# EAGLE board Arduino_kuukulgur-alternatiivne3 (EAGLE 6.3)
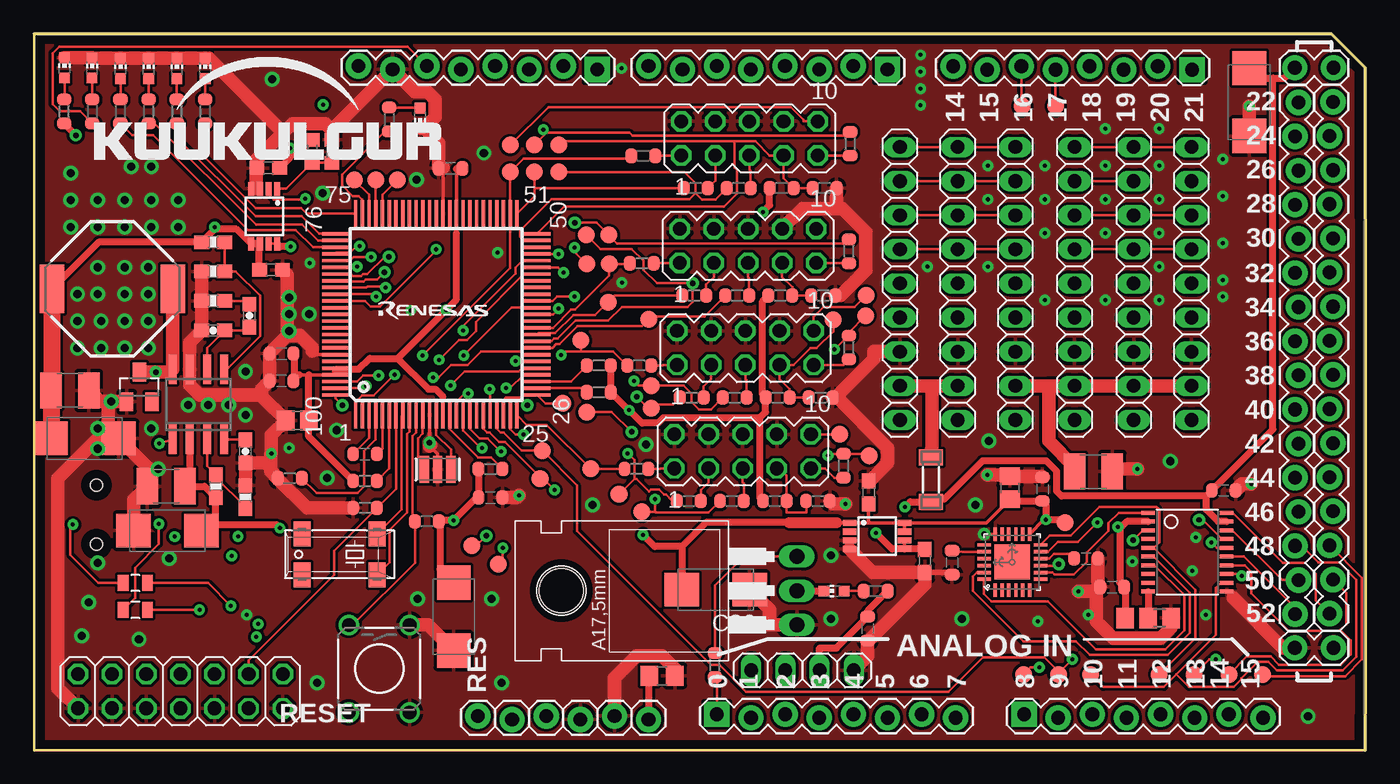
[diagram p8: board, top side]
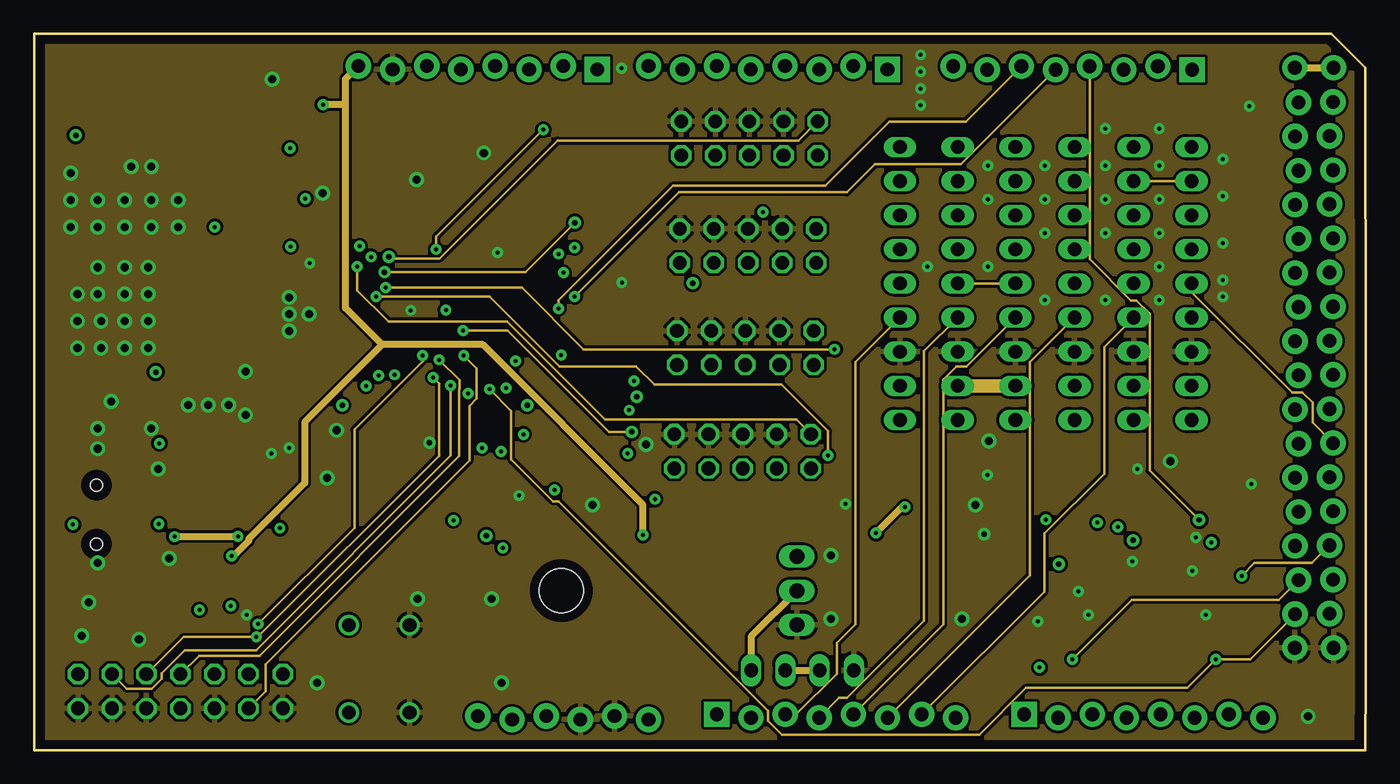
[diagram p9: board, inner layer Route2]
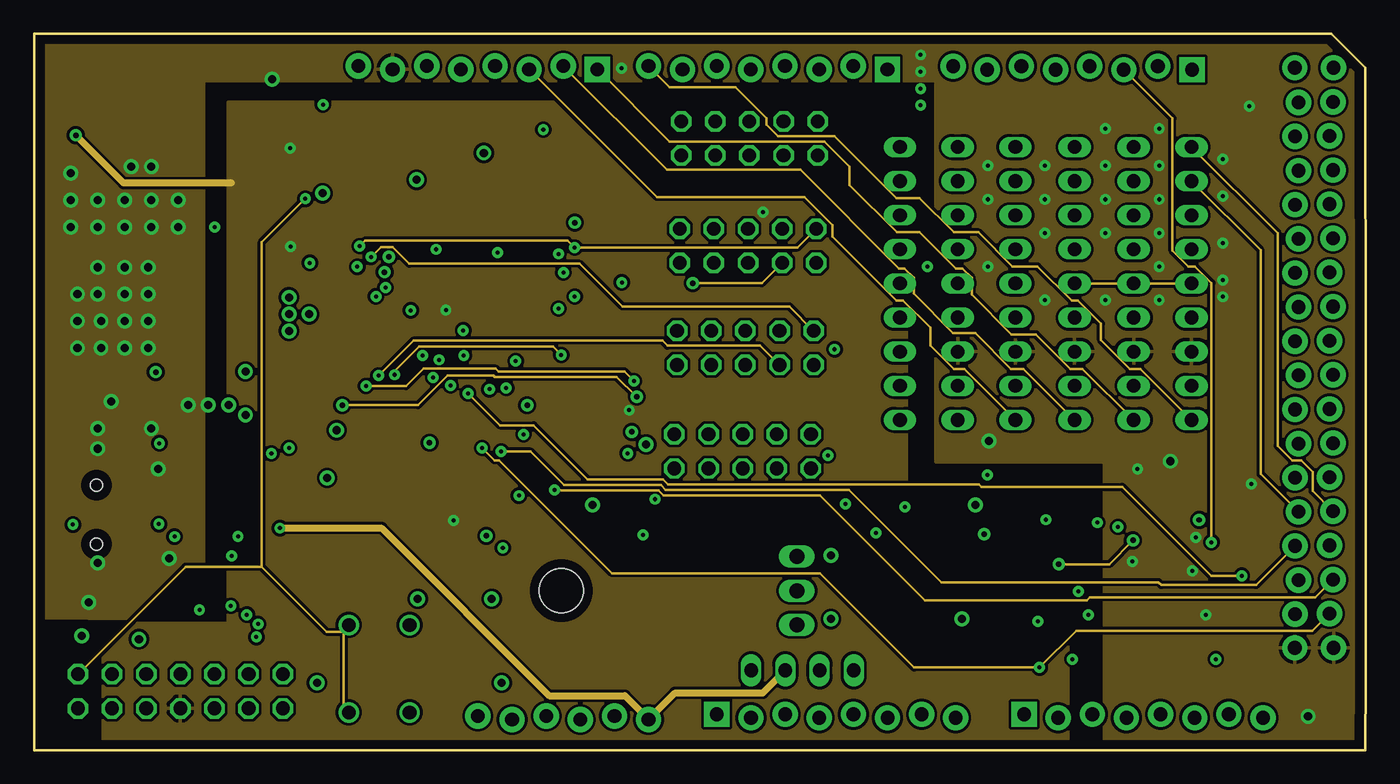
[diagram p10: board, inner layer Route15]
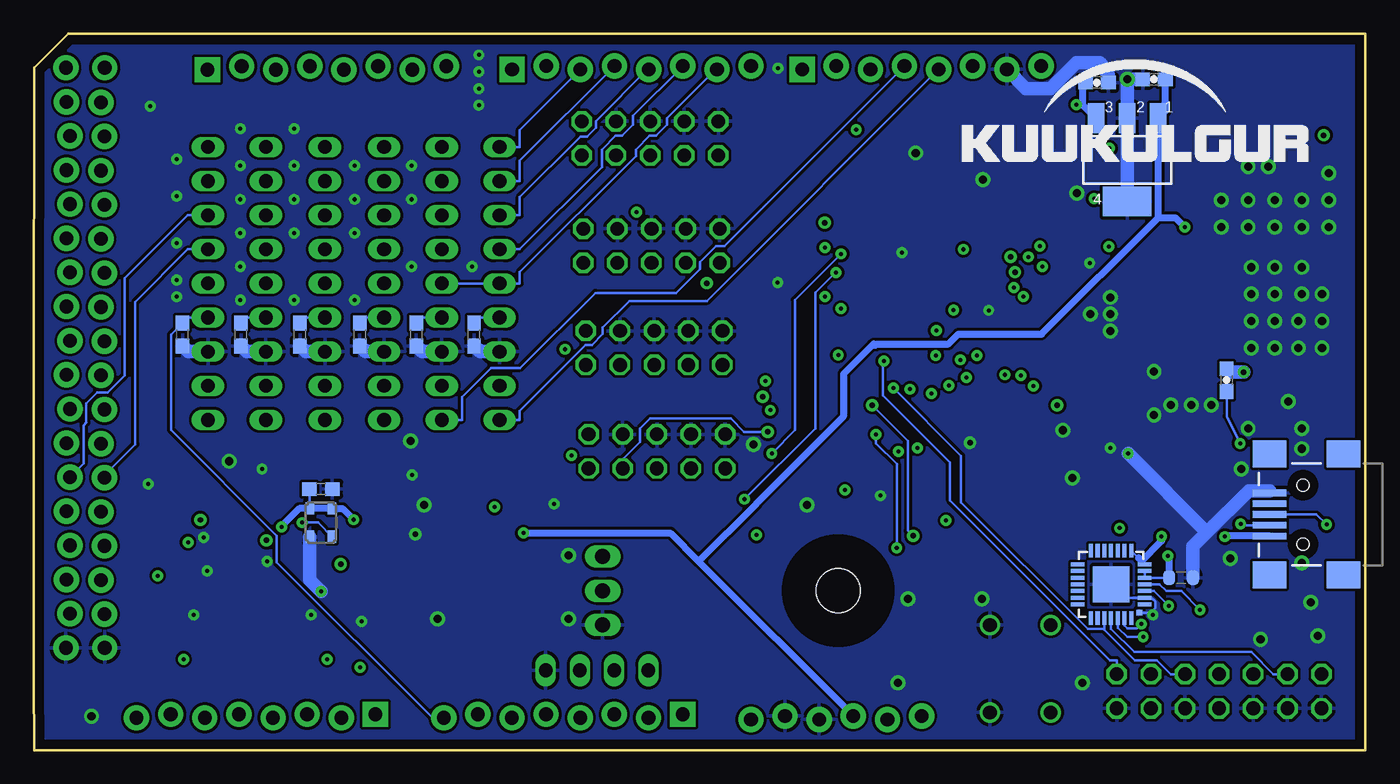
[diagram p11: board, bottom side, seen from below]

Size 99.1 x 53.34 mm. Coordinates in mm from the lower left corner, seen from the top.
Outline: 0,0 99.06,0 99.06,1.27 99.1,4.11 99.1,38.4 99.06,40.64 99.06,50.8 96.52,53.34 0,53.34 0,0
Copper layers (1*2+15*16): Top 0.035mm / dielectric 0.2mm / Route2 0.035mm / dielectric 0.15mm / Route15 0.035mm / dielectric 0.2mm / Bottom 0.035mm
Design rules "default *": minimum track width 8mil, minimum drill 16mil, track to track 6mil, track to pad 7mil, pad to pad 8mil, via to via 10mil, smd to smd 7mil, copper to edge 27mil, drill to drill 12mil, minimum pad ring 10mil, minimum via ring 10mil, stop-mask expansion 2mil, vias tented up to drill 24mil, thermal gap 10mil
Net classes: 0 default: width 0.203 mm, drill 0.203 mm, clearance 0.203 mm; 1 power: width 0.508 mm, drill 0.508 mm, clearance 0.203 mm; 2 morepower: width 1.016 mm, drill 0.508 mm, clearance 0.203 mm; 3 gnd: width 0.305 mm, drill 0.305 mm, clearance 0.203 mm

## Footprints (pad centres in the part's own frame; a part is rotated, then mirrored left to right if it is on the bottom)
C0603-ROUND = smd 0.898 x 1.1: 1 -0.889,0; 2 0.889,0
C0805 = smd 1.3 x 1.5: 1 -0.95,0; 2 0.95,0
0603-CAP = smd 1.1 x 1: 1 -0.85,0; 2 0.85,0
C0805' = smd 1.3 x 1.5: 1 -0.85,0; 2 0.85,0
C1210 = smd 1.6 x 2.7: 1 -1.4,0; 2 1.4,0
C0603 = smd 1.1 x 1: 1 -0.85,0; 2 0.85,0
C/6032-28R = smd 2.55 x 2.5: + 2.525,0; - -2.525,0
SOT23 = smd 1 x 1.4: 1 -0.95,-1.1; 2 0.95,-1.1; 3 0,1.1
MSOP8 = smd 0.45 x 1: 1 -0.975,-2.05; 2 -0.325,-2.05; 3 0.325,-2.05; 4 0.975,-2.05; 5 0.975,2.05; 6 0.325,2.05; 7 -0.325,2.05; 8 -0.975,2.05
MLP28 = smd 1 x 0.3: 1 -2.5,1.5; 2 -2.5,1; 3 -2.5,0.5; 4 -2.5,0; 5 -2.5,-0.5; 6 -2.5,-1; 7 -2.5,-1.5; 15 2.5,-1.5; 16 2.5,-1; 17 2.5,-0.5; 18 2.5,0; 19 2.5,0.5; 20 2.5,1; 21 2.5,1.5 | smd 0.3 x 1: 8 -1.5,-2.5; 9 -1,-2.5; 10 -0.5,-2.5; 11 0,-2.5; 12 0.5,-2.5; 13 1,-2.5; 14 1.5,-2.5; 22 1.5,2.5; 23 1,2.5; 24 0.5,2.5; 25 0,2.5; 26 -0.5,2.5; 27 -1,2.5; 28 -1.5,2.5 | smd 2.7 x 2.7: EXP 0,0 | smd 0.435 x 0.435: M -2.103,2.103
SOT223 = smd 1.219 x 2.235: 1 -2.311,-3.099; 2 0,-3.099; 3 2.311,-3.099 | smd 3.6 x 2.2: 4 0,3.099
B0R-JMP = smd 1.5 x 1.3: 1 0,1.7; 2 0,0; 3 0,-1.7
1X08_LOCK = drill 1.016 pad 1.88 square: 1 0,0.127 | drill 1.016 pad 1.88: 2 2.54,-0.127; 3 5.08,0.127; 4 7.62,-0.127; 5 10.16,0.127; 6 12.7,-0.127; 7 15.24,0.127; 8 17.78,-0.127
1X02 = drill 1.016 long: 1 -1.27,0; 2 1.27,0
1X16_LOCK = drill 1.016 pad 1.88: 1 0,0.127; 2 2.54,-0.127; 3 5.08,0.127; 4 7.62,-0.127; 5 10.16,0.127; 6 12.7,-0.127; 7 15.24,0.127; 8 17.78,-0.127; 9 20.32,0.127; 10 22.86,-0.127; 11 25.4,0.127; 12 27.94,-0.127; 13 30.48,0.127; 14 33.02,-0.127; 15 35.56,0.127; 16 38.1,-0.127
1X06_LOCK = drill 1.016 pad 1.88: 1 0,0; 2 2.54,-0.254; 3 5.08,0; 4 7.62,-0.254; 5 10.16,0; 6 12.7,-0.254
1X02_LOCK = drill 1.016 pad 1.88: 1 -0.178,0; 2 2.718,0
1X09 = drill 1.016 long: 1 -10.16,0; 2 -7.62,0; 3 -5.08,0; 4 -2.54,0; 5 0,0; 6 2.54,0; 7 5.08,0; 8 7.62,0; 9 10.16,0
2X07 = drill 1.016 octagon: 1 -7.62,-1.27; 2 -7.62,1.27; 3 -5.08,-1.27; 4 -5.08,1.27; 5 -2.54,-1.27; 6 -2.54,1.27; 7 0,-1.27; 8 0,1.27; 9 2.54,-1.27; 10 2.54,1.27; 11 5.08,-1.27; 12 5.08,1.27; 13 7.62,-1.27; 14 7.62,1.27
SRU1038 = smd 1.8 x 3.6: 1 -4.5,0; 2 4.5,0
SM-1206 = smd 1.2 x 1.8: 1 -1.65,0; 2 1.65,0
CHIP-LED0603 = smd 0.8 x 0.8: A 0,-0.75; C 0,0.75
100P6Q-A = smd 0.25 x 2: 1 -6,-7.5; 2 -5.5,-7.5; 3 -5,-7.5; 4 -4.5,-7.5; 5 -4,-7.5; 6 -3.5,-7.5; 7 -3,-7.5; 8 -2.5,-7.5; 9 -2,-7.5; 10 -1.5,-7.5; 11 -1,-7.5; 12 -0.5,-7.5; 13 0,-7.5; 14 0.5,-7.5; 15 1,-7.5; 16 1.5,-7.5; 17 2,-7.5; 18 2.5,-7.5; 19 3,-7.5; 20 3.5,-7.5; 21 4,-7.5; 22 4.5,-7.5; 23 5,-7.5; 24 5.5,-7.5; 25 6,-7.5; 51 6,7.5; 52 5.5,7.5; 53 5,7.5; 54 4.5,7.5; 55 4,7.5; 56 3.5,7.5; 57 3,7.5; 58 2.5,7.5; 59 2,7.5; 60 1.5,7.5; 61 1,7.5; 62 0.5,7.5; 63 0,7.5; 64 -0.5,7.5; 65 -1,7.5; 66 -1.5,7.5; 67 -2,7.5; 68 -2.5,7.5; 69 -3,7.5; 70 -3.5,7.5; 71 -4,7.5; 72 -4.5,7.5; 73 -5,7.5; 74 -5.5,7.5; 75 -6,7.5 | smd 2 x 0.25: 26 7.5,-6; 27 7.5,-5.5; 28 7.5,-5; 29 7.5,-4.5; 30 7.5,-4; 31 7.5,-3.5; 32 7.5,-3; 33 7.5,-2.5; 34 7.5,-2; 35 7.5,-1.5; 36 7.5,-1; 37 7.5,-0.5; 38 7.5,0; 39 7.5,0.5; 40 7.5,1; 41 7.5,1.5; 42 7.5,2; 43 7.5,2.5; 44 7.5,3; 45 7.5,3.5; 46 7.5,4; 47 7.5,4.5; 48 7.5,5; 49 7.5,5.5; 50 7.5,6; 76 -7.5,6; 77 -7.5,5.5; 78 -7.5,5; 79 -7.5,4.5; 80 -7.5,4; 81 -7.5,3.5; 82 -7.5,3; 83 -7.5,2.5; 84 -7.5,2; 85 -7.5,1.5; 86 -7.5,1; 87 -7.5,0.5; 88 -7.5,0; 89 -7.5,-0.5; 90 -7.5,-1; 91 -7.5,-1.5; 92 -7.5,-2; 93 -7.5,-2.5; 94 -7.5,-3; 95 -7.5,-3.5; 96 -7.5,-4; 97 -7.5,-4.5; 98 -7.5,-5; 99 -7.5,-5.5; 100 -7.5,-6
MA05-2 = drill 1.016 octagon: 1 -5.08,-1.27; 2 -5.08,1.27; 3 -2.54,-1.27; 4 -2.54,1.27; 5 0,-1.27; 6 0,1.27; 7 2.54,-1.27; 8 2.54,1.27; 9 5.08,-1.27; 10 5.08,1.27
MM20SS = smd 1.27 x 1.88: 1 -2.794,-1.524; 2 2.794,-1.524; 3 2.794,1.524; 4 -2.794,1.524
R0603-ROUND = smd 0.898 x 1.1: 1 -0.889,0; 2 0.889,0
0603-RES = smd 1.1 x 1: 1 -0.85,0; 2 0.85,0
0805 = smd 0.8 x 1.2: 1 -0.9,0; 2 0.9,0
R0603 = smd 1 x 1.1: 1 -0.85,0; 2 0.85,0
TACTILE-PTH = drill 1.016: 1 -3.251,2.261; 2 3.251,2.261; 3 -3.251,-2.261; 4 3.251,-2.261
TO220 = drill 1.118 long: 1 -2.54,-6.35; 2 0,-6.35; 3 2.54,-6.35 | hole 3.302: 0,11.176
B1,27 = smd 1.27 x 1.27: TP 0,0
QFN-24-TESTING = smd 1.016 x 0.254: 1 -2.066,1.257; 2 -2.066,0.75; 3 -2.066,0.247; 4 -2.066,-0.287; 5 -2.066,-0.792; 6 -2.066,-1.297; 13 2.086,-1.297; 14 2.086,-0.792; 15 2.086,-0.287; 16 2.086,0.247; 17 2.086,0.75; 18 2.086,1.257 | smd 0.254 x 1.016: 7 -1.267,-2.122; 8 -0.762,-2.122; 9 -0.258,-2.122; 10 0.278,-2.122; 11 0.78,-2.122; 12 1.287,-2.122; 19 1.287,2.082; 20 0.78,2.082; 21 0.278,2.082; 22 -0.258,2.082; 23 -0.762,2.082; 24 -1.267,2.082 | smd 2.616 x 2.616: P$1 0.02,-0.01
TSSOP20 = smd 0.305 x 0.991: 1 -2.925,-2.918; 2 -2.275,-2.918; 3 -1.625,-2.918; 4 -0.975,-2.918; 5 -0.325,-2.918; 6 0.325,-2.918; 7 0.975,-2.918; 8 1.625,-2.918; 9 2.275,-2.918; 10 2.925,-2.918; 11 2.925,2.918; 12 2.275,2.918; 13 1.625,2.918; 14 0.975,2.918; 15 0.325,2.918; 16 -0.325,2.918; 17 -0.975,2.918; 18 -1.625,2.918; 19 -2.275,2.918; 20 -2.925,2.918
ASE = smd 0.9 x 0.65: 1 -1.05,-0.825; 2 1.05,-0.825; 3 1.05,0.825; 4 -1.05,0.825
SO8 = smd 0.6 x 2.2: 1 -1.905,-2.6; 2 -0.635,-2.6; 3 0.635,-2.6; 4 1.905,-2.6; 5 1.905,2.6; 6 0.635,2.6; 7 -0.635,2.6; 8 -1.905,2.6
USB-MINIB = smd 2.5 x 0.5: D+ 2.5,0; D- 2.5,0.8; GND 2.5,-1.6; ID 2.5,-0.8; VBUS 2.5,1.6 | smd 2.5 x 2: GND@1 -3,-4.5; GND@2 -3,4.5; GND@3 2.5,4.5; GND@4 2.5,-4.5 | hole 0.9: 0,2.2; 0,-2.2
RESONATOR = smd 0.7 x 2: 1 -1,0; 2 0,0; 3 1,0

## Placement (x,y rotation side)
C1  100n  [C0603-ROUND]  18.41,29.52 180 top
C2  2.2nF, 50V  [C0603-ROUND]  68.31,13.95 90 top
C3  100n  [C0603-ROUND]  78.26,14.27 180 top
C4  100n  [C0603-ROUND]  30.98,43.31 180 top
C5  220n  [C0603-ROUND]  18.41,27.49 180 top
C6  100n  [C0603-ROUND]  33.96,18.8 0 top
C7  1uF/16V  [C0805]  46.72,5.54 0 top
C8  100n  [C0603-ROUND]  62.02,9.04 270 top
C9  180pF  [0603-CAP]  16.02,32.34 90 top
C10  4,7uF  [C0603-ROUND]  24.62,22.04 180 top
C11  12pF  [0603-CAP]  13.32,31.24 180 top
C12  47uF  [C0805']  72.6,19.53 90 top
C13  GRM32ER71E226KE15L  [C1210]  9.82,19.64 180 top
C14  GRM32ER71E226KE15L  [C1210]  2.66,26.78 0 top
C15  0.1  [0603-CAP]  10.32,27.54 270 bottom
C16  100n  [C0603-ROUND]  75.02,19.44 270 top
C17  100n  [C0603-ROUND]  80.22,12.14 0 top
C18  100n  [C0603-ROUND]  88.52,19.34 180 top
C19  47uF  [C0805']  19.58,24.53 180 top
C20  [C0603]  66.32,30.94 90 bottom
C21  [C0603]  70.62,30.94 90 bottom
C22  [C0603]  74.82,30.94 90 bottom
C23  [C0603]  79.27,30.94 90 bottom
C24  [C0603]  83.67,30.94 90 bottom
C25  [C0603]  88.02,30.94 90 bottom
C26  1uF/6V  [C0603]  17.42,43.34 180 top
C27  15nF  [0603-CAP]  15.72,22.24 90 top
C28  1uF/6V  [C0603]  17.62,35.74 0 top
C29  100uF/6V  [C/6032-28R]  31.22,9.94 90 top
C30  100uF/16V  [C/6032-28R]  9.92,16.34 0 top
C31  100uF/10V  [C/6032-28R]  90.42,48.24 90 top
C32  GRM32ER71E226KE15L  [C1210]  78.82,20.74 0 top
C33  100n  [C0603-ROUND]  13.72,12.84 0 bottom
C34  1uF/6V  [C0603]  62.09,19.19 90 top
C35  1uF/6V  [C0603]  66.28,14.09 270 top
C36  100uF/6V  [C/6032-28R]  50.72,11.94 180 top
C37  0.1  [0603-CAP]  19.97,49.69 0 bottom
C38  10nF  [C0603]  77.72,19.44 0 bottom
C45  0.1  [0603-CAP]  15.72,49.94 180 bottom
C100  100uF/10V  [C/6032-28R]  3.75,23.21 180 top
D100  BAT54  [SOT23]  7.82,27.04 0 top
IC1  TPS77333DGK  [MSOP8]  62.72,15.94 270 top
IC2  TPS77301DGK  [MSOP8]  17.12,39.74 180 top
IC4  CP2103_USB_UART  [MLP28]  18.92,12.34 180 bottom
IC8  LM2936MP-3.3  [SOT223]  17.72,43.94 180 bottom
JMP1  0R-JUMPB  [B0R-JMP]  82.89,9.83 90 top
JP1  [1X08_LOCK]  86.16,50.78 180 top
JP2  [1X02]  54.62,5.94 180 top
JP3  [1X08_LOCK]  41.91,50.8 180 top
JP4  [1X08_LOCK]  63.49,50.8 180 top
JP5  [1X02]  59.72,5.94 0 top
JP6  [1X08_LOCK]  73.66,2.54 0 top
JP7  [1X08_LOCK]  50.8,2.54 0 top
JP8  M16LOCK  [1X16_LOCK]  96.52,10.16 90 top
JP9  M16LOCK  [1X16_LOCK]  93.96,48.22 270 top
JP10  [1X06_LOCK]  33.02,2.54 0 top
JP11  [1X02_LOCK]  93.98,7.62 0 top
JP12  [1X02_LOCK]  93.98,50.8 0 top
JP13  [1X09]  86.12,34.74 270 top
JP14  [1X09]  81.82,34.74 270 top
JP15  [1X09]  77.42,34.74 270 top
JP16  [1X09]  73.02,34.74 270 top
JP17  [1X09]  68.72,34.74 270 top
JP18  [1X09]  64.42,34.74 270 top
JP19  [2X07]  10.88,4.39 180 top
L1  [SRU1038]  5.82,34.34 180 top
L4  LB3218T220K  [SM-1206]  66.72,20.14 90 top
LED1  Blue  [CHIP-LED0603]  2.25,50.79 0 top
LED2  Blue  [CHIP-LED0603]  4.31,50.78 0 top
LED3  Blue  [CHIP-LED0603]  6.42,50.74 0 top
LED4  Blue  [CHIP-LED0603]  8.52,50.74 0 top
LED5  Blue  [CHIP-LED0603]  10.62,50.74 0 top
LED6  Blue  [CHIP-LED0603]  12.72,50.74 0 top
LED7  Yellow  [CHIP-LED0603]  59.52,11.84 90 top
LED8  Red  [CHIP-LED0603]  28.72,47.04 180 top
MCU  R32C111  [100P6Q-A]  29.92,32.44 0 top
MOTOR0  [MA05-2]  53.12,37.54 0 top
MOTOR1  [MA05-2]  52.92,29.94 0 top
MOTOR2  [MA05-2]  52.72,22.24 0 top
MOTOR3  [MA05-2]  53.22,45.54 0 top
Q1  [MM20SS]  22.72,14.58 180 top
R1  82R  [R0603-ROUND]  52.12,26.24 0 top
R2  82R  [R0603-ROUND]  52.32,33.84 0 top
R3  1k2  [R0603-ROUND]  50.66,6.34 270 top
R4  220R  [R0603-ROUND]  58.52,26.24 0 top
R5  220R  [R0603-ROUND]  55.32,26.24 0 top
R6  82R  [R0603-ROUND]  48.92,26.24 0 top
R7  180R  [R0603-ROUND]  45.02,28.64 0 top
R8  220R  [R0603-ROUND]  60.63,29.97 90 top
R9  220R  [R0603-ROUND]  58.72,33.84 0 top
R10  220R  [R0603-ROUND]  55.52,33.84 0 top
R11  82R  [R0603-ROUND]  49.12,33.84 0 top
R12  180R  [R0603-ROUND]  45.22,36.24 0 top
R13  220R  [R0603-ROUND]  60.62,37.14 90 top
R14  82R  [R0603-ROUND]  52.42,41.84 0 top
R15  220R  [R0603-ROUND]  58.82,41.84 0 top
R16  220R  [R0603-ROUND]  55.62,41.84 0 top
R17  82R  [R0603-ROUND]  49.22,41.84 0 top
R18  180R  [R0603-ROUND]  45.32,44.24 0 top
R19  220R  [R0603-ROUND]  60.72,45.14 90 top
R20  82R  [R0603-ROUND]  51.92,18.54 0 top
R21  220R  [R0603-ROUND]  58.32,18.54 0 top
R22  220R  [R0603-ROUND]  55.12,18.54 0 top
R23  82R  [R0603-ROUND]  48.72,18.54 0 top
R24  180R  [R0603-ROUND]  44.82,20.94 0 top
R25  220R  [R0603-ROUND]  60.22,21.16 90 top
R26  4k7  [R0603-ROUND]  24.62,20.04 180 top
R27  1k  [R0603-ROUND]  2.22,47.54 90 top
R28  1k  [R0603-ROUND]  4.32,47.54 90 top
R29  63k4  [0603-RES]  13.32,33.44 0 top
R30  4k7  [R0603-ROUND]  29.22,17.04 0 top
R31  4k7  [R0603-ROUND]  33.95,20.93 180 top
R32  4k7  [R0603-ROUND]  42.02,28.64 180 top
R33  4k7  [R0603-ROUND]  42.02,26.64 180 top
R34  4k7  [R0603-ROUND]  24.62,18.04 180 top
R35  100k  [0603-RES]  13.52,19.64 270 top
R36  1k87  [0603-RES]  13.32,35.64 180 top
R37  10k  [0603-RES]  13.32,37.81 0 top
R38  1k  [R0603-ROUND]  6.42,47.54 90 top
R39  1k  [R0603-ROUND]  8.52,47.54 90 top
R40  1k  [R0603-ROUND]  10.62,47.54 90 top
R41  1k  [R0603-ROUND]  12.72,47.54 90 top
R42  3k3  [R0603-ROUND]  62.62,11.84 180 top
R43  1k  [R0603-ROUND]  26.42,46.94 90 top
R44  47k  [R0603-ROUND]  19.02,20.24 180 top
R45  21k5  [0603-RES]  15.72,18.84 270 top
R46  22r  [0805]  7.52,12.44 180 top
R47  22r  [0805]  7.52,10.44 180 top
R48  118k  [R0603]  20.69,44.58 90 top
R49  42.2k  [R0603]  22.15,44.58 270 top
S1  [TACTILE-PTH]  25.67,6.06 270 top
T1  BD651  [TO220]  50.4,11.87 90 top
TP1  TPB1,27  [B1,27]  73.62,5.64 180 top
TP2  TPB1,27  [B1,27]  76.22,5.64 180 top
TP3  TPB1,27  [B1,27]  39.34,25.81 0 top
TP4  TPB1,27  [B1,27]  83.72,5.64 90 top
TP5  TPB1,27  [B1,27]  86.32,5.64 90 top
TP6  TPB1,27  [B1,27]  88.92,5.64 90 top
TP7  TPB1,27  [B1,27]  91.42,5.64 90 top
TP8  TPB1,27  [B1,27]  78.62,5.64 0 top
TP9  TPB1,27  [B1,27]  42.78,36.2 90 top
TP10  TPB1,27  [B1,27]  42.71,33.35 90 top
TP11  TPB1,27  [B1,27]  45.75,32.07 90 top
TP12  TPB1,27  [B1,27]  41.1,38.35 90 top
TP13  TPB1,27  [B1,27]  42.76,38.34 90 top
TP14  TPB1,27  [B1,27]  41.1,36.2 90 top
TP15  TPB1,27  [B1,27]  40.68,30.51 90 top
TP16  TPB1,27  [B1,27]  45.92,25.44 90 top
TP17  TPB1,27  [B1,27]  45.92,27.14 90 top
TP18  TPB1,27  [B1,27]  59.46,32.05 90 top
TP19  TPB1,27  [B1,27]  61.87,32.35 90 top
TP20  TPB1,27  [B1,27]  61.9,33.84 90 top
TP21  TPB1,27  [B1,27]  41.42,20.94 90 top
TP22  TPB1,27  [B1,27]  43.52,19.04 90 top
TP23  TPB1,27  [B1,27]  45.22,17.74 90 top
TP24  TPB1,27  [B1,27]  41.12,25.14 90 top
TP25  TPB1,27  [B1,27]  62.14,21.9 90 top
TP26  TPB1,27  [B1,27]  59.94,23.52 90 top
TP27  TPB1,27  [B1,27]  35.42,43.04 90 top
TP28  TPB1,27  [B1,27]  37.22,43.04 90 top
TP29  TPB1,27  [B1,27]  39.02,43.04 90 top
TP30  TPB1,27  [B1,27]  39.02,45.04 90 top
TP31  TPB1,27  [B1,27]  37.22,45.04 90 top
TP32  TPB1,27  [B1,27]  35.42,45.04 90 top
TP33  TPB1,27  [B1,27]  76.72,16.94 0 top
TP35  TPB1,27  [B1,27]  73.52,47.94 0 top
TP36  TPB1,27  [B1,27]  76.02,47.94 0 top
TP37  TPB1,27  [B1,27]  37.81,22.3 0 top
TP38  TPB1,27  [B1,27]  37.64,20.22 0 top
TP39  TPB1,27  [B1,27]  23.82,42.44 0 top
TP40  TPB1,27  [B1,27]  25.42,42.44 0 top
TP41  TPB1,27  [B1,27]  27.02,42.44 0 top
TP43  TPB1,27  [B1,27]  34.52,13.84 0 top
TP44  TPB1,27  [B1,27]  32.55,15.21 0 top
U1  MPU-6000QFN-24  [QFN-24-TESTING]  72.77,13.99 90 top
U2  txb0108  [TSSOP20]  85.82,14.74 270 top
U$1  ASE  [ASE]  77.72,16.94 270 bottom
U$3  TPS54332  [SO8]  12.22,25.74 0 top
X2  USBSMD  [USB-MINIB]  4.62,17.54 180 bottom
Y1  CSTCE8M00G15C99-R0  [RESONATOR]  30.02,20.91 0 top

## Tracks (layer width: path | path; a pad name or v marks a point on that pad's centre or on a via)
+3V3  (via drill 0.3 pad 0.81)
  Top 0.254: IC1.8 IC1.7 | 59.72,16.94 59.74,16.92 IC1.1 62.09,16.92 | C34.1 62.09,16.92 | 62.09,16.92 IC1.8 | IC1.8 70.84,16.92 72.38,18.45 | 72.6,18.45 72.6,18.55 C12.1 | v75.28,17.16 75.15,17.16 U1.13
  Top 0.508: TP33.TP 76.5,17.16 v75.28,17.16 75.28,18.3 C16.2 72.6,18.55 | 72.38,18.45 72.6,18.45 | U2.2 81.3,17.02 80.78,16.49 | v80.65,16.61 80.78,16.49 | 80.78,16.49 80.78,12.47 C17.2 81.19,12.06 JMP1.1 | 48.2,15.15 C36.+ | 56.2,16.94 49.98,16.94 48.2,15.15 | 48.2,15.15 46.16,15.15 v45.3,16.01
  Top 0.813: 56.2,16.94 59.72,16.94
  Route2 0.508: 23.17,48.06 v21.49,48.06 | 23.17,48.06 23.17,49.97 JP3.8 | 25.89,30.18 23.17,32.9 23.17,48.06 | v45.3,16.01 45.3,18.27 33.39,30.18 25.89,30.18 | 25.89,30.18 20.13,24.42 20.13,19.89 15.97,15.73 15.97,15.58 14.83,14.45 v14.69,14.45
  Bottom 0.203: C33.1 IC4.5 IC4.6 | U$1.1 78.57,18.02 C38.1
  Bottom 0.508: v75.28,17.16 76.11,17.99 U$1.4 U$1.1 79.34,17.99 80.65,16.68 v80.65,16.61 | v14.69,14.45 14.61,14.37 C33.1 | v21.49,48.06 21.05,48.06 | C37.1 21.05,49.46 21.05,48.06 | 21.05,48.06 21.05,48.05 IC8.3
+4V5  (via drill 0.3 pad 0.81, 0.41 pad 0.91)
  Top 0.203: IC2.8 IC2.7
  Top 0.25: 22.42,28.2 MCU.96 22.5,28.36 | 22.42,28.19 MCU.97 20.43,27.94 19.72,27.94 | 31.42,43.27 MCU.60 31.42,38.48 | 19.38,27.94 19.71,27.94 | 30.42,26.32 MCU.14
  Top 0.508: R27.1 v3.1,45.77 | 22.42,28.19 22.42,28.2 | C4.1 31.46,43.31 31.42,43.27 | R31.2 C6.1 | C6.1 | 30.19,17.04 R30.2 | 30.19,17.04 30.19,13.49 C29.+ | 30.19,17.04 30.25,17.1 v31.2,17.1 32.9,18.8 C6.1 | R48.2 20.06,44.8 v19.04,44.8 19.04,44.1 C26.1 | 53.99,24.73 46.8,24.73 46.42,24.35 45.24,24.35 v44.28,25.31 44.24,25.31 R33.1 R32.1 | 53.99,24.73 53.99,18.78 R22.1 | v54.22,40.05 54.73,40.55 R16.1 | 53.99,24.73 54.43,25.17 R5.1 54.21,26.46 54.21,33.42 R10.1 | C5.1 19.3,27.86 19.38,27.94 19.38,29.45 C1.1 | 19.72,27.94 19.71,27.94 | 20.43,27.94 C19.1 20.43,23.34 R26.2 | 27.05,29.17 29.34,26.88 29.86,26.88 30.42,26.32 | 22.5,28.36 24.15,28.36 24.96,29.17 27.05,29.17 | 27.05,29.17 v30.64,32.76 31.42,33.54 31.42,38.48 | v19.08,37.48 18.31,37.48 IC2.8
  Route15 0.508: 14.68,42.22 6.65,42.22 v3.1,45.77
  pour Route15: 76.92,0.24 76.92,19.84 64.92,19.84 64.92,48.24 14.42,48.24 14.42,9.44 5.12,9.44 5.12,0.14 77.02,0.14
+5V  (via drill 0.3 pad 0.81)
  Top 0.203: 16.42,37.69 IC2.5 | IC2.6 16.7,37.69 16.47,37.69
  Top 0.254: IC1.5 IC1.6
  Top 0.508: 16.47,37.69 16.42,37.69 | 16.7,37.69 16.7,35.81 C28.1 | 1.32,26.84 C14.1 | 1.26,23.24 C100.+ | C35.1 66.26,14.96 IC1.5 63.85,14.96 v62.65,16.16 | L1.2 4.79,37.81 R37.1 13.44,38.78 | IC2.5 15.05,38.78 13.44,38.78 | 13.44,38.78 v13.44,38.94 | v64.8,18.1 65.19,18.49 L4.1 67.72,18.69 70.57,21.54 75.31,21.54 76.09,20.76 76.09,19.28 76.45,18.92 87.21,18.92 | U2.19 88.11,17.02 87.21,17.92 87.21,18.92 | 87.21,18.92 C18.2 92.18,23.89 92.18,50.03 | C31.+ 91.15,50.03 92.18,50.03 | 92.18,50.03 93.03,50.03 JP12.1
  Top 1.27: L1.2 1.32,26.84 | C14.1 1.26,23.24
  Route2 0.508: JP12.1 JP12.2 | v64.8,18.1 64.59,18.1 v62.65,16.16
  Bottom 0.508: C45.1 14.87,47.58 IC8.1 15.41,39.64 | 15.41,39.64 14.13,39.64 v13.44,38.94 | v62.65,16.16 51.72,16.16 49.6,14.04 | 49.6,14.04 JP10.3 | 49.6,14.04 45.32,18.33 45.32,18.36 38.8,24.88 38.8,28.03 36.66,30.17 36.39,30.17 36.57,30.23 31.02,30.23 30.29,30.96 24.09,30.96 15.41,39.64
+5V_A
  Top 1.016: L4.2 66.79,22.72 66.79,27.12 | JP17.8 66.79,27.12 | 66.79,27.12 JP18.8 | JP13.8 JP14.8 JP15.8 75.49,27.12 | JP16.8 75.49,27.12 | C32.1 77.42,21.07 75.49,23 75.49,27.12
  Route2 1.016: JP17.8 JP16.8
_CLK0
  Top 0.203: R11.1 43.2,33.84 TP10.TP 41.75,32.39 40.12,32.39 38.77,31.03 37.51,31.03 MCU.35
_CLK3
  Top 0.203: R17.1 37.22,41.84 | TP28.TP 37.22,41.84 | 37.22,41.84 37.22,41.24 MCU.51
_CLK4  (via drill 0.41 pad 0.91)
  Top 0.203: v22.92,25.68 22.42,26.18 MCU.100 | 45.92,25.73 TP16.TP | R6.1 47.52,25.73 45.92,25.73 | 45.92,25.73 45.41,25.73 v44.83,26.31
  Route15 0.203: v44.83,26.31 43.35,27.79 34.27,27.79 34.18,27.88 30.76,27.88 28.56,25.68 v22.92,25.68
_CLK6  (via drill 0.3 pad 0.81)
  Top 0.203: v39.01,36.94 MCU.47 | 44.66,20.18 44.66,21.6 v44.17,22.1 | R23.1 47.48,18.54 47,19.02 46.85,19.02 46.48,19.39 45.89,19.39 45.75,19.25 44.82,20.18 44.66,20.18 | 44.66,20.18 TP22.TP
  Bottom 0.203: v39.01,36.94 42.44,33.5 42.44,23.82 v44.17,22.1
_CRESET0  (via drill 0.41 pad 0.91)
  Top 0.203: v40.23,39.26 41.84,39.26 TP13.TP 43.38,37.72 60.31,37.72 R13.2 | v26.07,35.58 25.51,35.02 24.66,35.02 24.5,34.87 22.49,34.87 MCU.83
  Route2 0.203: v40.23,39.26 36.55,35.58 v26.07,35.58
_CRESET1  (via drill 0.3 pad 0.81)
  Top 0.203: MCU.84 24.71,34.44 24.79,34.52 26.05,34.52 v26.14,34.44 | TP19.TP 60.62,31.1 R8.2 60.58,30.86 v59.56,29.84
  Route2 0.203: v59.56,29.84 40.89,29.84 36.29,34.44 v26.14,34.44
_CRESET2  (via drill 0.3 pad 0.81)
  Top 0.203: TP25.TP 61.98,22.05 R25.2 59.18,22.05 v59.07,21.94 | v25.43,33.77 25.27,33.94 MCU.85
  Route2 0.203: v59.07,21.94 59.07,23.74 55.61,27.2 46.15,27.2 44.79,28.57 39.11,28.57 33.9,33.77 v25.43,33.77
_CRESET3  (via drill 0.3 pad 0.81)
  Top 0.203: v29.9,37.28 29.9,37.19 25.73,33.02 25.05,33.02 24.63,33.44 MCU.86 | 38.13,45.95 v37.88,46.19 | R19.2 60.43,45.74 44.52,45.74 44.3,45.96 38.14,45.96 38.13,45.95 | 38.13,45.95 TP31.TP
  Route2 0.203: v37.88,46.19 29.9,38.21 v29.9,37.28
_CS0
  Top 0.203: R12.1 44.29,36.2 TP9.TP 42.78,35.32 40.25,32.8 39.95,32.8 38.6,31.44 MCU.36
_CS2
  Top 0.203: R24.1 TP21.TP 38.14,24.22 36.64,24.22 MCU.25
_CS3  (via drill 0.3 pad 0.81)
  Top 0.203: v28.9,29.36 35.42,35.88 MCU.52 TP27.TP 36.42,44.04 44.23,44.04 R18.1
  Route2 0.203: v28.9,29.36 28.9,28.93 23.83,23.86 23.83,16.55 v16.66,9.38
  Bottom 0.203: IC4.27 17.92,9.28 17.7,9.06 16.99,9.06 v16.66,9.38
_CS4  (via drill 0.3 pad 0.81)
  Top 0.203: v26.82,27.94 25.27,26.4 24.39,26.4 23.92,25.93 MCU.1 | 40.68,29.69 TP15.TP | R7.1 43.08,29.69 40.68,29.69 | 40.68,29.69 39.5,29.69 v39.22,29.41
  Route15 0.203: v39.22,29.41 38.6,30.03 28.62,30.03 26.82,28.22 v26.82,27.94
_MISO0  (via drill 0.41 pad 0.91)
  Top 0.203: R9.1 R10.2 56.41,34.48 55.66,35.23 MOTOR0.7 | TP12.TP 42.13,37.31 44.46,37.31 45.35,36.43 45.35,35.75 46.34,34.77 v49,34.77 49,33.36 48.63,32.99 43.73,32.99 42.71,31.96 40.27,31.96 38.93,30.62 38.68,30.62 38.5,30.44 MCU.34
  Route15 0.203: MOTOR0.7 54.16,34.77 v49,34.77
_MISO3
  Top 0.203: 52.13,45.33 53.66,45.33 54.72,44.27 MOTOR3.7 55.76,42.59 R16.2 R15.1 | 52.13,45.33 52.13,43.36 52.3,43.18 52.3,41.41 51.34,40.46 39.44,40.46 MCU.50 | TP30.TP 39.31,45.33 52.13,45.33
_MISO4  (via drill 0.3 pad 0.81)
  Top 0.203: TP18.TP 59.46,31.18 58.22,29.94 57.77,29.94 56.5,28.67 MOTOR1.7 55.46,27.63 56.21,26.88 R5.2 R4.1 | v25.62,27.88 24.46,27.88 24.02,27.44 MCU.98
  Route15 0.203: MOTOR1.7 54.02,30.11 47.12,30.11 46.75,30.48 28.22,30.48 v25.62,27.88
_MISO6  (via drill 0.3 pad 0.81, 0.41 pad 0.91)
  Top 0.203: v31.93,31.25 31.93,31.57 35.83,35.47 35.83,35.91 36.36,36.44 37.42,36.44 | R21.1 57.47,18.44 57.47,17.69 55.97,17.69 55.97,18.44 R22.2 55.97,18.69 55.97,20.44 55.47,20.94 MOTOR2.7 | v44.47,23.69 42.97,25.19 41.22,25.19 TP24.TP
  Route2 0.203: v44.47,23.69 42.77,23.69 35.21,31.25 v31.93,31.25
  Bottom 0.203: v44.47,23.69 46.22,23.69 47.22,24.69 53.22,24.69 53.97,23.94 53.97,22.94 55.22,21.69 55.22,21.19 MOTOR2.7
_MOSI0
  Top 0.203: R2.1 49.87,32.28 45.95,32.28 TP11.TP 45.23,31.56 40.44,31.56 39.1,30.22 38.85,30.22 38.57,29.94 MCU.33
_MOSI3
  Top 0.203: 49.22,41.47 49.22,42.2 48.38,43.04 TP29.TP | R14.1 50.69,40.99 49.7,40.99 49.22,41.47 | 49.22,41.47 48.75,41.01 38.49,41.01 36.14,38.66 36.14,38.22 36.42,37.94 MCU.49
_MOSI4  (via drill 0.3 pad 0.81)
  Top 0.203: R1.1 50.36,25.37 49.48,25.37 48.92,25.93 48.92,26.55 48.33,27.14 TP17.TP 44.97,27.14 v44.63,27.48 | v24.69,27.11 24.52,26.94 MCU.99
  Route15 0.203: v44.63,27.48 43.92,28.2 34.54,28.2 34.34,28.4 28.96,28.4 27.67,27.11 v24.69,27.11
_MOSI6  (via drill 0.3 pad 0.81)
  Top 0.203: TP23.TP 46.19,17.74 | R20.1 50.18,17.69 46.24,17.69 46.19,17.74 | 46.19,17.74 v46.19,18.68 | MCU.45 38.99,35.94 v39.38,35.55
  Bottom 0.203: v46.19,18.68 40.93,23.94 40.93,34.06 39.44,35.55 v39.38,35.55
A0
  Top 0.203: R3.2 50.8,5.31 JP7.1
A2
  Route2 0.203: JP18.6 61.11,28.89 61.11,9.37 59.72,7.99 59.72,5.7 56.69,2.67 JP7.3
  Bottom 0.203: JP18.6 65.92,32.2 65.92,32.19 C20.2
A3
  Route2 0.203: JP17.6 66.22,29.7 66.22,9.63 60.48,3.89 59.9,3.89 JP7.4
  Bottom 0.203: JP17.6 70.22,32.2 70.22,32.19 C21.2
A4
  Route2 0.203: JP7.5 67.65,9.35 67.65,27.59 68.63,28.57 69.39,28.57 JP16.6
  Bottom 0.203: JP16.6 74.52,32.2 74.52,32.09 C22.2
A5
  Route2 0.203: JP15.6 74.11,28.89 74.11,13.02 JP7.6
  Bottom 0.203: JP15.6 78.92,32.2 78.92,32.14 C23.2
A6
  Route2 0.203: JP14.6 79.62,30 79.62,20.57 75.17,16.12 75.17,11.8 JP7.7
  Bottom 0.203: JP14.6 83.32,32.2 83.32,32.14 C24.2
A7
  Bottom 0.203: JP13.6 87.62,32.2 87.62,32.19 C25.2 88.87,30.94 88.87,23.84 81,15.96 81,13.99 69.42,2.41 JP7.8
CDONE0  (via drill 0.3 pad 0.81)
  Top 0.203: TP14.TP 40.22,37.08 v40.22,37.42 | v24.22,37.52 23.99,37.52 23.5,37.03 22.51,37.03 | 22.51,37.03 | 22.51,37.03 MCU.79
  Route15 0.203: MOTOR0.10 56.81,37.42 v40.22,37.42 39.7,37.94 24.64,37.94 v24.22,37.52
CDONE1  (via drill 0.3 pad 0.81)
  Top 0.203: MOTOR1.10 58,32.25 58.72,32.97 61.03,32.97 TP20.TP | v25.06,36.72 23.77,36.72 23.49,36.44 MCU.80
  Route15 0.203: MOTOR1.10 56.19,33.02 43.77,33.02 40.58,36.21 27.91,36.21 26.66,37.46 25.8,37.46 v25.06,36.72
CDONE2  (via drill 0.3 pad 0.81)
  Top 0.203: TP26.TP 58.85,23.52 58.84,23.51 MOTOR2.10 | v24.04,35.98 22.46,35.98 MCU.81
  Route2 0.203: MOTOR2.10 56.71,24.6 42.49,24.6 35.19,31.91 26.36,31.91 24.04,34.22 v24.04,35.98
CDONE3  (via drill 0.41 pad 0.91)
  Top 0.203: TP32.TP 38.26,47.88 56.3,47.88 57.26,46.92 57.26,46.81 MOTOR3.10 | v26.39,36.72 26.06,36.72 24.78,35.43 24.49,35.43 24.33,35.27 23.74,35.27 23.58,35.44 MCU.82
  Route2 0.203: v26.39,36.72 26.5,36.61 30.17,36.61 38.94,45.38 56.87,45.38 MOTOR3.10
CLK0
  Top 0.203: R11.2 50.01,34.66 50.58,35.23 MOTOR0.3
CLK2
  Top 0.203: R23.2 49.61,19.36 50.18,19.93 MOTOR2.3
CLK3
  Top 0.203: MOTOR3.3 50.68,42.41 R17.2
CLK4
  Top 0.203: R6.2 49.81,27.06 50.38,27.63 MOTOR1.3
CNVSS
  Top 0.203: JP19.3 15.96,6.7 22.31,13.05 22.31,14.84 R34.1 26.92,19.45 MCU.7
CPOUT
  Top 0.203: U1.20 69.06,14.77 C2.2
CRESET0
  Top 0.203: R13.1 59.26,36.25 59.24,36.27 MOTOR0.9
CRESET1
  Top 0.203: MOTOR1.9 60.21,28.67 R8.1
CRESET2
  Top 0.203: R25.1 59.54,20.27 58.84,20.97 MOTOR2.9
CRESET3
  Top 0.203: R19.1 59.36,44.25 59.34,44.27 MOTOR3.9
CS0
  Top 0.203: R12.2 46.97,36.24 47,36.27 MOTOR0.1
CS2
  Top 0.203: R24.2 46.57,20.94 46.6,20.97 MOTOR2.1
CS3
  Top 0.203: R18.2 47.07,44.24 47.1,44.27 MOTOR3.1
CS4
  Top 0.203: R7.2 46.77,28.64 46.8,28.67 MOTOR1.1
CS_GYRO_3V
  Top 0.203: U2.1 80.7,17.67 79.94,16.91 79.94,16.33 78.34,14.72 78.34,14.03 77.38,13.07 75.92,13.07 75.76,13.23 U1.8
CS_GYRO_5V_D53  (via drill 0.3 pad 0.81)
  Top 0.203: U2.20 89.2,17.67 92.93,13.93 94.57,13.93 95.39,13.12 95.39,11.17 JP8.1 | v74.81,6.16 74.14,6.16 TP1.TP | MCU.17 31.92,23.78 33.21,22.5 v33.33,22.5
  Route15 0.203: JP8.1 95.12,8.88 77.54,8.88 v74.81,6.16 65.47,6.16 58.47,13.16 43,13.16 34.59,21.58 34.25,21.58 v33.33,22.5
CS_MOTOR_5V_D49  (via drill 0.3 pad 0.81)
  Top 0.203: JP8.3 96.41,15.24 98.81,12.84 98.81,6.77 97.55,5.51 91.55,5.51 TP7.TP | U2.13 89.73,13.12 v89.86,12.98 | MCU.16 31.42,25.97 32.01,26.56 v32.27,26.56
  Route2 0.203: v89.86,12.98 90.81,13.93 95.08,13.93 JP8.3
  Route15 0.203: v32.27,26.56 34.66,24.17 37.18,24.17 41.19,20.15 46.79,20.15 47.17,19.78 70.31,19.78 70.5,19.6 80.97,19.6 87.59,12.98 v89.86,12.98
D2
  Top 0.203: JP18.1 JP17.1 JP16.1
  Bottom 0.203: JP18.1 62.92,44.9 62.92,46.16 JP4.3
D3
  Top 0.203: JP16.2 JP17.2 JP18.2
  Bottom 0.203: JP18.2 62.92,42.36 62.92,43.88 JP4.4
D4
  Top 0.203: JP16.3 JP17.3 JP18.3
  Bottom 0.203: JP18.3 62.92,39.82 62.92,41.16 58.39,45.68 57.91,45.68 57.26,46.33 57.26,46.83 53.41,50.67 JP4.5
D5
  Top 0.203: JP16.4 JP17.4 JP18.4
  Bottom 0.203: JP18.4 62.92,37.28 56.81,43.39 56.81,44.71 55.8,45.73 55.31,45.73 54.49,46.55 54.49,47.23 JP4.6
D6
  Route2 0.203: JP17.5 JP16.5
  Bottom 0.203: JP17.5 JP18.5 62.92,34.74 62.92,35.57 54.27,44.22 54.27,44.71 53.26,45.72 52.77,45.72 51.95,46.54 51.95,47.05 48.33,50.67 JP4.7
D7
  Route15 0.203: JP13.9 82.31,28.39 81.53,28.39 79.39,30.53 79.39,31.74 77.66,33.47 77.21,33.47 74.67,36.01 72.79,36.01 70.25,38.55 68.43,38.55 65.89,41.09 64.17,41.09 59.54,45.72 55.34,45.72 54.49,46.56 54.49,47.06 52.2,49.35 47.29,49.35 JP4.8
D8
  Route15 0.203: JP14.9 78.01,28.39 77.1,28.39 74.55,30.94 72.73,30.94 69.76,33.91 69.76,35.17 69.07,35.87 68.58,35.87 65.89,38.55 64.19,38.55 60.69,42.05 60.69,43.43 58.8,45.31 47.27,45.31 JP3.1
D9
  Route15 0.203: JP15.9 73.61,28.39 72.69,28.39 70.02,31.06 68.38,31.06 65.46,33.98 65.46,35.17 64.77,35.87 64.34,35.87 57,43.21 47.09,43.21 JP3.2
D10
  Route15 0.203: JP16.9 69.21,28.39 68.43,28.39 66.69,30.13 66.69,31.45 64.66,33.47 64.17,33.47 59.41,38.23 59.41,39.07 57.32,41.17 46.34,41.17 JP3.3
D11
  Bottom 0.203: JP17.9 67.22,24.58 67.22,26.3 65.07,28.45 62.9,28.45 57.3,34.04 51.29,34.04 49.51,35.82 49.51,36.33 48.32,37.52 47.7,37.52 JP3.4
D12
  Bottom 0.203: JP18.9 62.92,24.58 62.92,25.25 58.02,30.16 57.56,30.16 56.75,30.96 56.75,31.46 54.77,33.44 48.98,33.44 JP3.5
D13
  Top 0.203: R28.1 3.41,47.56 1.91,47.56 1.37,48.09 1.37,51.88 1.85,52.35 27.78,52.35 JP3.6
D18  (via drill 0.41 pad 0.91)
  Top 0.203: U2.17 88.37,15.71 86.95,17.14 v86.69,17.14
  Route2 0.203: JP1.4 78.54,36.54 81.61,33.47 82.03,33.47 83.02,32.48 83.02,20.82 v86.69,17.14
D19  (via drill 0.3 pad 0.81)
  Top 0.203: U2.16 88.02,15.06 v87.61,15.48
  Route15 0.203: v87.61,15.48 87.61,34.77 86.37,36.01 85.89,36.01 84.7,37.2 84.7,47.03 JP1.3
D43
  Route2 0.203: JP13.5 86.12,34.11 93.6,26.63 94.36,26.63 95.13,25.86 95.13,24.37 JP8.6
  Route15 0.203: JP15.5 JP14.5 JP13.5
D44
  Top 0.203: JP13.4 JP14.4 JP15.4
  Bottom 0.203: JP9.12 93.83,20.47 91.53,22.77 91.53,33.37 87.62,37.28 JP13.4
D45
  Top 0.203: JP13.3 JP14.3 JP15.3
  Bottom 0.203: JP13.3 87.62,39.82 92.31,35.13 92.31,27.91 93.58,26.63 94.36,26.63 95.17,25.81 95.17,24.38 95.39,24.17 95.39,21.33 JP8.5
D46
  Top 0.203: JP15.2 JP14.2
  Route2 0.203: JP14.2 JP13.2
  Route15 0.203: JP9.13 91.27,20.56 91.27,37.21 JP13.2
D47
  Top 0.203: JP13.1 JP14.1 JP15.1
  Route15 0.203: JP13.1 92.53,38.49 92.53,22.65 93.63,21.55 94.29,21.55 95.13,20.71 95.13,19.29 JP8.4
D+  (via drill 0.3 pad 0.81)
  Top 0.203: R46.2 4.77,12.44 2.7,14.52 2.7,16.61 v2.88,16.79
  Bottom 0.203: X2.D+ 3.63,17.54 v2.88,16.79
D-  (via drill 0.3 pad 0.81)
  Top 0.203: v9.28,16.83 9.28,15.34 7.52,13.58 7.52,11.34 R47.2
  Bottom 0.203: X2.D- 9.19,16.74 v9.28,16.83
E8_BUSY  (via drill 0.3 pad 0.81)
  Top 0.203: v29.69,27.74 30.1,27.74 31.02,28.66 32.26,28.66 33.27,29.67 36.12,29.67 36.36,29.44 MCU.32
  Route2 0.203: JP19.9 11.11,8.42 v16.53,8.42 16.64,8.42 30.13,21.92 30.13,27.3 v29.69,27.74
  Bottom 0.203: IC4.26 18.42,9.12 17.72,8.42 v16.53,8.42
E8_CLK  (via drill 0.3 pad 0.81)
  Top 0.203: MCU.31 35.86,28.94 v35.83,28.96
  Bottom 0.203: JP19.1 18.5,6.7 19.02,6.7 30.89,18.57 30.89,21.4 35.88,26.39 35.88,28.91 v35.83,28.96
E8_RX  (via drill 0.3 pad 0.81)
  Top 0.203: MCU.30 36.32,28.44 36.06,28.18 32.03,28.18 v30.99,27.14
  Route2 0.203: v30.99,27.14 30.99,21.93 16.51,7.45 11.2,7.45 9.48,5.73 9.48,5.31 8.73,4.57 6.88,4.57 JP19.11
  Bottom 0.203: JP19.11 6.84,5.66 8.49,7.31 17.18,7.31 18.92,9.05 IC4.25
E8_TX  (via drill 0.3 pad 0.81)
  Top 0.203: v35.12,26.96 35.42,26.96 36.41,27.94 MCU.29
  Bottom 0.203: JP19.5 14.46,5.66 15.5,6.7 17.15,6.7 19.42,8.97 19.42,9.02 | v35.12,26.96 30.08,21.91 30.08,18.46 20.65,9.02 19.42,9.02 | 19.42,9.02 IC4.24
ENABLE_PANDA
  Top 0.203: U$3.3 12.86,21.16 R35.1 13.52,20.3 15.72,18.1 R45.2
GND  (via drill 0.3 pad 0.81, 0.41 pad 0.91, 0.6 pad 1.11)
  Top 0.203: IC2.4 16.51,41.79 IC2.3
  Top 0.25: 29.42,22.64 30.02,22.04 Y1.2 | MCU.12 v29.42,22.89 29.42,22.79 29.5,22.71 | 20.68,29.71 20.95,29.44 MCU.94 | 30.42,43.34 MCU.62
  Top 0.254: v70.69,16.08 U1.18
  Top 0.305: 89.22,11.33 U2.11
  Top 0.406: IC1.4 IC1.3 | C35.2 68.13,13.24 C2.1
  Top 1.016: C29.- 29.32,9.31 S1.1 | D100.1 v5.72,25.94 | 16.82,26.44 C19.2 17.65,23.45 v17.65,22.08 17.59,22.03 17.59,21.39 | T1.1 54.7,9.33 54.7,10.49 C36.- | 16.82,26.44 16.91,26.53 16.91,26.88 C5.2 C1.2 17.52,29.55 18.83,30.86 | MOTOR0.8 57.15,40.3 59.71,40.3 | R15.2 59.71,40.3 | LED1.C 4.29,51.54 LED2.C 4.34,51.49 LED3.C LED4.C LED5.C LED6.C 13.01,51.49 18.54,45.96 | R36.2 R29.1 C11.2 11.59,30.36 U$3.7 11.59,27.17 12.31,26.44 16.82,26.44 | 29.42,22.64 29.5,22.71 | 16.51,41.79 16.51,43.28 C26.2 16.57,44 18.54,45.96 | 59.71,40.3 60.13,40.3 61.89,38.54 61.89,35.73 60,33.84 R9.2 | IC1.4 62.39,13.24 C35.2 66.28,12.34 62.09,8.15 C8.2 62.02,6.97 JP5.2 | C3.1 79.15,12.32 C17.1 79.02,11.83 | C30.- 7.39,18.62 C13.2 8.42,21.06 C100.- 5.51,23.21 | v60.37,18.32 59.43,18.32 R21.2 | 79.02,11.83 79.02,9.61 80.3,8.33 83.81,8.33 84.59,9.1 JMP1.3 | v77.7,11.83 79.02,11.83 | v82.11,20.93 80.41,20.93 C32.2 | v90.42,47.94 C31.- | JP11.1 92.93,7.62 89.22,11.33 | 29,46.29 29.85,47.13 29.85,48.44 29.26,49.02 28.32,49.02 JP3.7 22.14,46.15 | LED8.C 29,46.29 | JP10.5 43.18,5.37 44.82,7.01 46.72,7.01 47.67,6.06 C7.2 | JP18.7 62.49,29.66 62.49,29.12 59.69,26.32 | 59.69,26.32 63.51,22.49 63.51,21.37 62.18,20.04 C34.2 | 59.69,26.32 59.61,26.24 R4.2 | 5.51,23.21 5.51,25.94 4.9,25.94 C14.2 | 5.51,23.21 4.74,23.21 1.76,20.23 1.76,4.61 JP19.14 | R34.2 20.3,18.04 18.13,20.21 R44.2 17.59,20.78 17.59,21.39 | 17.59,21.39 C27.1 R45.1 | v36.07,18.95 35.92,18.8 C6.2 | 22.14,46.15 R49.1 | 22.14,46.15 21.65,46.65 19.22,46.65 18.54,45.96 | 18.83,30.86 18.83,35.38 C28.2 | 18.83,30.86 19.78,30.86 20.68,29.95 20.68,29.71 | 30.09,43.34 30.42,43.34
  Top 1.016: 29,46.29 30.09,45.2 30.09,43.34 | 30.09,43.34 C4.2 | C16.1 74.97,20.38 C12.2 72.5,20.48 v70.93,20.48 | v90.58,19.81 89.88,19.81 C18.1
  Bottom 0.203: v15.82,10.08 15.99,10.25 | IC4.EXP 17.92,11.34 IC4.2 15.91,11.34 15.64,11.07 15.64,10.6 15.99,10.25 | 15.99,10.25 16.01,10.24 IC4.M
  Bottom 0.5: 7.12,19.3 X2.GND
  Bottom 1.016: IC8.4 IC8.2 v17.72,49.94 C45.2 | v77.7,11.83 78.55,12.68 U$1.2 | JP16.7 74.39,29.66 C22.1 | JP15.7 78.84,29.66 C23.1 | JP14.7 83.24,29.66 C24.1 | JP13.7 87.59,29.66 C25.1 | JP18.7 65.89,29.66 C20.1 | JP17.7 70.19,29.66 C21.1 | 11.78,16.21 v17.65,22.08 | 11.78,16.21 12.83,15.16 C33.2 | JP3.7 25.24,49.25 23.42,49.25 21.5,51.16 19.76,51.16 19.12,50.27 C37.2 | 11.78,16.21 8.69,19.3 7.12,19.3
  other vias: 45.54,22.76 4.72,23.94 4.72,22.44 8.72,43.44 7.22,43.44 15.72,28.19 3.22,33.94 8.47,33.94 8.47,35.94 18.96,31.21 18.96,33.7 18.96,32.45 14.46,25.71 12.96,25.71 11.46,25.71 41.54,18.26 4.72,13.94 71.04,23.01 84.54,21.51 94.79,2.51 70.04,18.26 69.04,9.76 59.29,14.51 59.29,9.76 34.79,5.01 21.04,5.01 3.54,8.51 7.79,8.26 4.04,11.01 10.04,14.26 34.04,11.26 28.54,11.26 18.96,22.5 43.71,50.75 65.96,51.75 65.96,50.5 65.96,49.25 65.96,48 83.71,46.25 79.71,46.25 88.46,44 88.46,41.25 88.46,37.75 88.46,35 88.46,33.75 66.46,36 83.71,33.5 79.71,33.5 75.21,33.5 70.96,36 70.96,41 70.96,43.5 75.21,43.5 75.21,41 75.21,38.5 83.71,36 83.71,43.5 79.71,43.5 79.71,41 83.71,41 83.71,38.5 79.71,38.5 43.73,34.82 20.51,36.26 28.02,32.74 34.47,37.05 33.46,44.45 28.46,42.45 21.46,41.45 20.46,32.45 22.5,23.82 21.79,20.26 15.72,24.94 8.72,23.94 9.22,20.94 2.72,42.94 10.72,40.94 8.72,40.94 10.72,38.94 8.72,38.94 6.72,40.94 4.72,40.94 2.72,40.94 2.72,38.94 4.72,38.94 6.72,38.94 6.72,35.94 6.72,33.94 4.72,35.94 4.72,33.94 3.22,31.94 4.97,31.94 6.72,31.94 8.47,31.94 8.47,29.94 6.72,29.94 4.97,29.94 3.22,29.94 87.2,10.08 86.45,15.83 78.45,10.08 74.7,9.58 86.2,13.33 81.72,14.06
  pour Route2: 99.62,0.04 99.62,53.64 0.02,53.64 0.02,0.04
  pour Route15: 12.62,9.84 12.62,49.84 67.12,49.84 67.12,21.44 79.62,21.44 79.62,0.24 99.12,0.24 99.12,53.24 -0.18,53.24 -0.08,9.84 12.22,9.74
  pour Bottom: -0.03,0.19 -0.03,53.44 99.22,53.44 99.22,-0.06 -0.03,-0.06
  pour Top: -0.28,53.44 98.97,53.44 98.97,-0.06 -0.28,-0.06
HOLD  (via drill 0.3 pad 0.81)
  Top 0.203: MCU.39 35.53,32.94 v31.97,29.37
  Route2 0.203: v31.97,29.37 32.94,28.4 32.94,26.17 32.39,25.62 32.39,21.57 17.23,6.41 17.23,4.39 JP19.4
INT_GYRO_3V
  Top 0.203: U2.5 83.3,15.06 | 83.3,15.06 83.71,15.47 83.71,17.91 83.51,18.11 79.28,18.11 77.15,15.98 75.59,15.98 U1.12 | TP4.TP 86.42,8.34 86.42,11.95 83.3,15.06
MISO_3V  (via drill 0.41 pad 0.91)
  Top 0.203: U2.3 82.52,16.37 v81.77,15.62 | U1.9 76.14,13.73 v76.25,13.84
  Route15 0.203: v81.77,15.62 79.99,13.84 v76.25,13.84
MISO_5V_D50  (via drill 0.3 pad 0.81)
  Top 0.203: U2.18 89.17,16.37 92.88,12.66 JP9.15 | v77.26,6.77 76.34,5.86 76.22,5.86 | 76.22,5.86 TP2.TP | MCU.22 34.42,23.95 34.72,23.64 34.93,23.64 36.28,22.3 TP37.TP 40.39,19.72 40.39,16.32 50.37,6.34 50.99,6.34 52.97,4.36 68.03,4.36 70.58,6.91 75.17,6.91 76.22,5.86
  Route2 0.203: JP9.15 92.6,11.17 81.66,11.17 v77.26,6.77
MOSI0
  Top 0.203: R2.2 53.21,35.14 53.12,35.23 MOTOR0.5
MOSI2
  Top 0.203: R20.2 52.81,19.84 52.72,19.93 MOTOR2.5
MOSI3
  Top 0.203: R14.2 53.31,43.14 53.22,43.23 MOTOR3.5
MOSI4
  Top 0.203: R1.2 53.01,27.54 52.92,27.63 MOTOR1.5
MOSI_3V
  Top 0.203: U2.7 83.36,13.76 85.59,11.54 85.59,8.91 84.19,7.51 78.99,7.51 75.44,11.07 71.23,11.07 70.69,11.62 U1.24
MOSI_5V_D51  (via drill 0.3 pad 0.81)
  Top 0.203: JP8.2 97.63,11.72 97.63,9.36 97.21,8.94 | 97.21,8.94 97.98,8.17 97.98,7.13 97.22,6.36 92.62,6.36 92.01,6.97 90.25,6.97 TP6.TP | 97.21,8.94 97.15,8.88 93.35,8.88 90.57,11.66 90.57,13.28 90.08,13.76 U2.14 | v38.72,19.36 37.86,20.22 TP38.TP 37.64,20.34 35.04,22.95 34.6,22.95 33.89,23.66 33.71,23.66 33.42,23.95 MCU.20
  Route15 0.203: JP8.2 95.34,11.39 78.57,11.39 78.35,11.16 66.27,11.16 58.46,18.97 46.83,18.97 46.46,19.34 38.74,19.34 v38.72,19.36
N$1
  Top 0.203: MCU.5 25.92,22.45 C10.1
N$2
  Top 0.508: T1.2 58.74,11.87 LED7.C
  Route2 0.508: T1.2 53.35,8.47 JP2.2
N$3
  Top 0.203: R44.1 21,19.15 24.08,19.15 24.55,19.62 24.55,22.27 25.42,23.14 MCU.4
N$5
  Top 0.203: MCU.3 24.92,23.23 C10.2
N$6
  Top 0.203: T1.3 52.82,14.41 50.66,12.25 R3.1
N$7
  Top 0.203: MCU.9 27.92,23.73 27.74,23.55 27.74,17.7 26.45,16.41 26.45,13.99 Q1.4
N$49
  Top 0.203: MCU.8 27.33,24.85 27.33,17.92 Q1.1
N$54
  Top 0.203: R26.1 26.42,20.95 MCU.6
N$55
  Top 0.203: R49.2 | R49.2 R48.1 18.74,41.79 IC2.1
N$73
  Top 0.508: U2.10 82.89,11.8 JMP1.2
N$84
  Top 0.203: MCU.15 30.92,23.91 33.04,21.79 33.98,21.79 R31.1
N$85
  Top 0.203: R42.2 LED7.A
N$96
  Top 0.203: U$3.4 15.67,23.14 C27.2
N$97
  Top 0.203: R38.2 LED3.A
N$108
  Top 0.203: R32.2 39.93,27.44 MCU.28
N$109
  Top 0.203: C9.1 15.77,31.24 C11.1 12.86,29.93 U$3.6
N$120
  Top 0.203: R29.2 15.77,33.44 C9.2
N$121  (via drill 0.3 pad 0.81)
  Top 0.203: U$3.1 v9.32,22.84
  Bottom 0.203: C15.2 10.32,24.84 v9.32,22.84
N$125
  Top 0.203: R37.2 R36.1 15,35.64 16.8,33.84 16.8,30.83 14.31,28.34 U$3.5
N$126
  Top 0.203: R27.2 2.25,48.46 LED1.A
N$127
  Top 0.203: R28.2 4.3,48.44 LED2.A
N$135
  Top 0.203: R33.2 40.83,26.94 MCU.27
N$138  (via drill 0.41 pad 0.91)
  Top 1.016: D100.3 v9.04,28.14 10.12,28.14 U$3.8 L1.1
  Bottom 1.016: v9.04,28.14 10.08,28.14 C15.1
N$149
  Top 0.203: R39.2 LED4.A
N$150
  Top 0.203: R40.2 LED5.A
N$161
  Top 0.203: R41.2 LED6.A
N$165
  Top 0.203: TP3.TP 38.05,25.81 MCU.26
N$166  (via drill 0.3 pad 0.81)
  Top 0.203: U1.11 75.45,14.77 76.18,15.5 77.67,15.5 v79.11,16.94
  Bottom 0.203: U$1.3 77.94,16.94 v79.11,16.94
N$206
  Top 0.203: R43.2 28.68,47.83 LED8.A
P1_0
  Top 0.203: R38.1 7.28,45.79 8.84,45.79 15.9,38.72 19.47,38.72 20.75,37.44 MCU.78
P1_1
  Top 0.203: MCU.77 21.11,37.94 19.93,39.13 16.5,39.13 8.98,46.65 R39.1
P1_2
  Top 0.203: MCU.76 21.19,38.44 19.89,39.74 16.47,39.74 10.62,45.59 R40.1
P1_3
  Top 0.203: MCU.75 20.26,39.94 19.86,40.35 16.46,40.35 12.72,44.09 R41.1
P1_4
  Top 0.203: R43.1 26.09,46.05 22.9,42.86 22.9,42.06 23.7,41.25 24.15,41.25 24.42,40.98 MCU.74
P1_5
  Top 0.203: TP39.TP 24.92,41.34 MCU.73
P1_6
  Top 0.203: TP40.TP MCU.72
P1_7
  Top 0.203: TP41.TP 25.92,41.34 MCU.71
P7_4  (via drill 0.3 pad 0.81)
  Top 0.203: v36.41,23.51 35.83,23.51 35.42,23.92 MCU.24 | TP43.TP 34.87,14.19 v34.87,15.06
  Bottom 0.203: v36.41,23.51 36.41,22.85 34.87,21.31 v34.87,15.06
P7_5  (via drill 0.41 pad 0.91)
  Top 0.203: TP44.TP 32.89,15.21 v33.64,15.95 | v36.68,25.67 36.11,26.24 35.13,26.24 34.92,26.03 MCU.23
  Bottom 0.203: v36.68,25.67 34.04,23.03 34.04,16.36 v33.64,15.95
REGOUT
  Top 0.203: U1.10 75.53,14.27 75.87,14.61 77.03,14.61 C3.2
RESET  (via drill 0.3 pad 0.81)
  Top 0.203: S1.3 23.71,9.31 28.33,13.93 R30.1 28.15,17.23 28.15,23.38 28.42,23.65 MCU.10 | v20.18,41.05 20.1,40.97 17.82,40.97 17.45,41.34 IC2.2
  Route15 0.203: 23.03,8.82 23.03,3.19 S1.4 | 23.03,8.82 23.41,9.2 S1.3 | 16.94,13.65 21.77,8.82 23.03,8.82 | 16.94,13.65 16.94,37.81 v20.18,41.05 | 16.94,13.65 11.25,13.65 JP19.13
RESET_MOTOR_5V_D48  (via drill 0.3 pad 0.81)
  Top 0.203: JP9.14 94.31,15.2 95.54,13.97 97.1,13.97 98.39,12.68 98.39,6.96 97.36,5.93 92.48,5.93 91.84,6.57 91.06,6.57 89.85,5.35 89.85,5.27 89.29,4.71 85.94,4.71 85,5.64 | U2.12 88.31,12.46 87.94,12.09 87.94,8.57 85,5.64 | 85,5.64 84.08,4.72 79.55,4.72 TP8.TP | MCU.18 32.42,23.91 33.13,23.2 33.73,23.2 34.7,22.23 v34.75,22.23 | v34.75,22.23
  Route15 0.203: JP9.14 90.93,12.3 83.86,12.3 83.67,12.49 67.5,12.49 60.61,19.38 47,19.38 46.63,19.75 39.43,19.75 36.94,22.23 v34.75,22.23
RX2  (via drill 0.3 pad 0.81)
  Top 0.203: TP36.TP 76,47.96 JP1.5 | v40.22,33.77 38.92,33.77 38.59,33.44 MCU.40
  Route2 0.203: JP1.5 68.98,43.63 62.58,43.63 60.48,41.52 47.98,41.52 v40.22,33.77
SCLK_3V
  Top 0.203: U1.23 70.17,13.23 69.87,12.93 69.87,11.86 73.61,8.12 77.52,8.12 78.55,7.09 84.36,7.09 86,8.72 86,11.71 83.29,14.41 U2.6
SCLK_5V_D52  (via drill 0.3 pad 0.81)
  Top 0.203: JP9.16 93.83,10.59 90,14.41 U2.15 | v87.93,6.77 87.45,6.77 TP5.TP | v33.88,26.87 33.92,26.82 MCU.21
  Route2 0.203: JP9.16 90.48,6.77 v87.93,6.77 85.8,4.64 73.81,4.64 70.33,1.16 55.65,1.16 54.61,2.2 54.61,2.93 39.02,18.52 38.62,18.52 35.49,21.64 35.49,25.25 v33.88,26.87
TX2  (via drill 0.3 pad 0.81)
  Top 0.203: TP35.TP 73.46,48 JP1.6 | MCU.38 38.59,32.44 v39.02,32.87
  Route2 0.203: JP1.6 69.34,46.78 63.63,46.78 58.87,42.02 47.54,42.02 39.02,33.5 v39.02,32.87
USBH4_DM  (via drill 0.3 pad 0.81)
  Top 0.203: R47.1 v12.3,10.44
  Bottom 0.203: IC4.4 15.32,12.34 14.82,11.84 13.7,11.84 v12.3,10.44
USBH4_DP  (via drill 0.3 pad 0.81)
  Top 0.203: R46.1 12.94,12.44 v14.64,10.74
  Bottom 0.203: IC4.3 15.73,11.84 v14.64,10.74
VBUS  (via drill 0.3 pad 0.81)
  Route2 0.508: v10.44,15.9 10.47,15.92 v15.16,15.92
  Bottom 0.203: 16.86,14.33 16.91,14.33 IC4.8 | IC4.7 16.64,14.06 | 16.67,14.09 16.86,14.28 16.86,14.29
  Bottom 0.508: 16.86,14.33 16.86,14.29 | X2.VBUS 10.4,15.94 v10.44,15.9 | 16.64,14.09 16.64,14.06 | 16.67,14.09 16.64,14.09 | 16.64,14.09 15.16,15.56 v15.16,15.92
VIN  (via drill 0.3 pad 0.81)
  Top 0.508: JP5.1 58.45,7.62 59.71,7.62 C8.1 62.02,10.35 R42.1 | JP10.6 45.77,2.34 C7.1 | 11.59,19.64 12.67,19.64 R35.2 13.52,16.78 | U$3.2 11.59,19.64 | 11.59,19.64 C13.1 | v18.28,16.53 18.03,16.78 13.52,16.78 | 13.52,16.78 12.89,16.78 C30.+
  Route2 0.508: JP2.1 JP5.1
  Route15 0.508: v18.28,16.53 25.85,16.53 38.32,4.05 43.95,4.05 JP10.6 47.7,4.27 54.21,4.27 JP2.1
WR  (via drill 0.3 pad 0.81)
  Top 0.203: v30.13,29.06 31.61,30.54 32.22,30.54 32.87,31.19 32.87,31.88 36.43,35.44 MCU.44
  Route2 0.203: JP19.7 12.26,7.04 16.77,7.04 31.62,21.89 31.62,26.84 31.65,26.87 31.65,27.54 v30.13,29.06
XIN
  Top 0.203: MCU.13 29.92,23.48 31.02,22.38 Y1.3
XOUT
  Top 0.203: MCU.11 28.92,23.58 28.55,23.21 28.55,21.37 Y1.1

## Text on the board
tPlace: 22 | 14 | 15 | 16 | 17 | 18 | 19 | 20 | 21 | 24 | 26 | 28 | 30 | 32 | 34 | 36 | 38 | 40 | 42 | 44 | 46 | 48 | 50 | 52 | ANALOG IN | 0 | 1 | 2 | 3 | 4 | 5 | 6 | 7 | 8 | 9 | 10 | 11 | 12 | 13 | 14 | 15 | RES | RESET
tNames: C:/Users/TS/Dropbox/kuukulgur.bmp
bNames: C:/Users/TS/Dropbox/kuukulgur.bmp